# EAGLE design mrf-single-row (EAGLE 5.12)
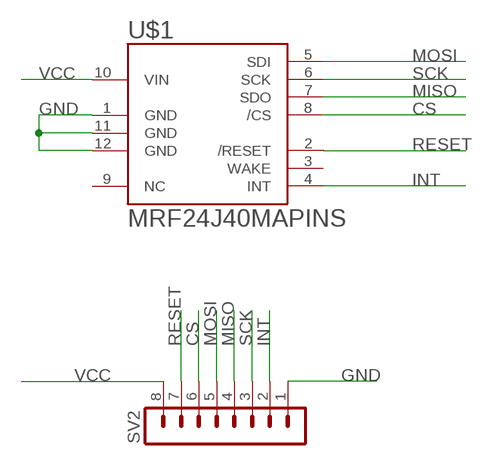
[diagram p0: schematic, sheet 1]

## Parts
SV2  MA08-1  [MA08-1]
U$1  MRF24J40MAPINS  [MRF24J40MA]

## Nets
CS: SV2.6 U$1.8(/CS)
GND: SV2.1 U$1.1(GND) U$1.11(GND) U$1.12(GND)
INT: SV2.2 U$1.4(INT)
MISO: SV2.4 U$1.7(SDO)
MOSI: SV2.5 U$1.5(SDI)
RESET: SV2.7 U$1.2(/RESET)
SCK: SV2.3 U$1.6(SCK)
VCC: SV2.8 U$1.10(VIN)
Unconnected: U$1.3(WAKE) U$1.9(NC)

## Library data of the parts
SV2 = con-lstb:MA08-1: PIN HEADER; OC_FARNELL: unknown; OC_NEWARK: unknown
U$1 = karlnet-parts:MRF24J40MA: MRF24J40MA module, 802.15.4 from microchip.

## Board
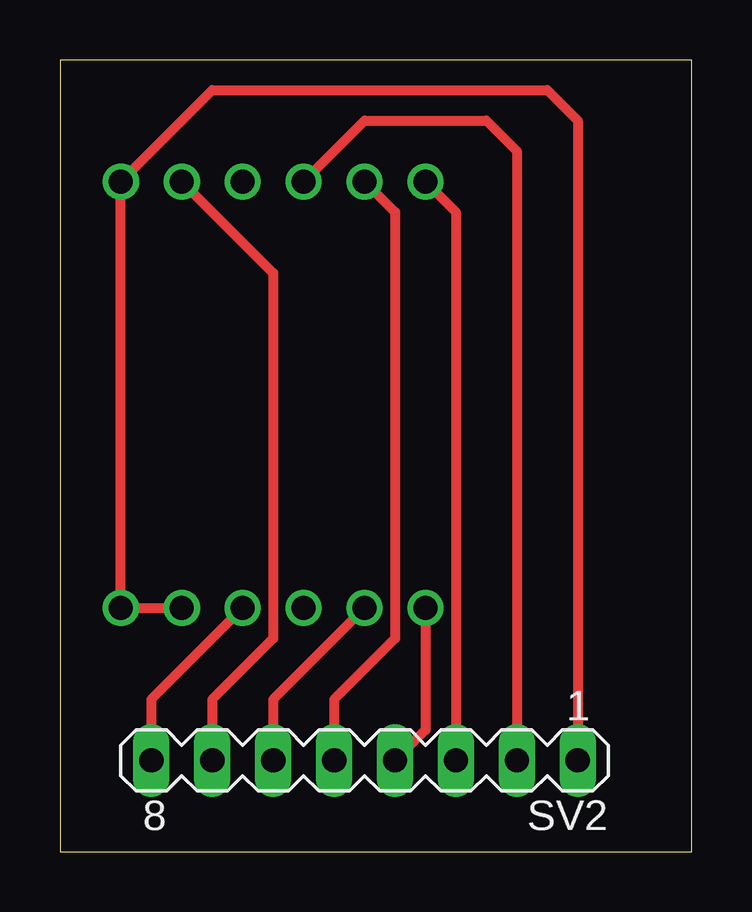
[diagram p1: board, top side]
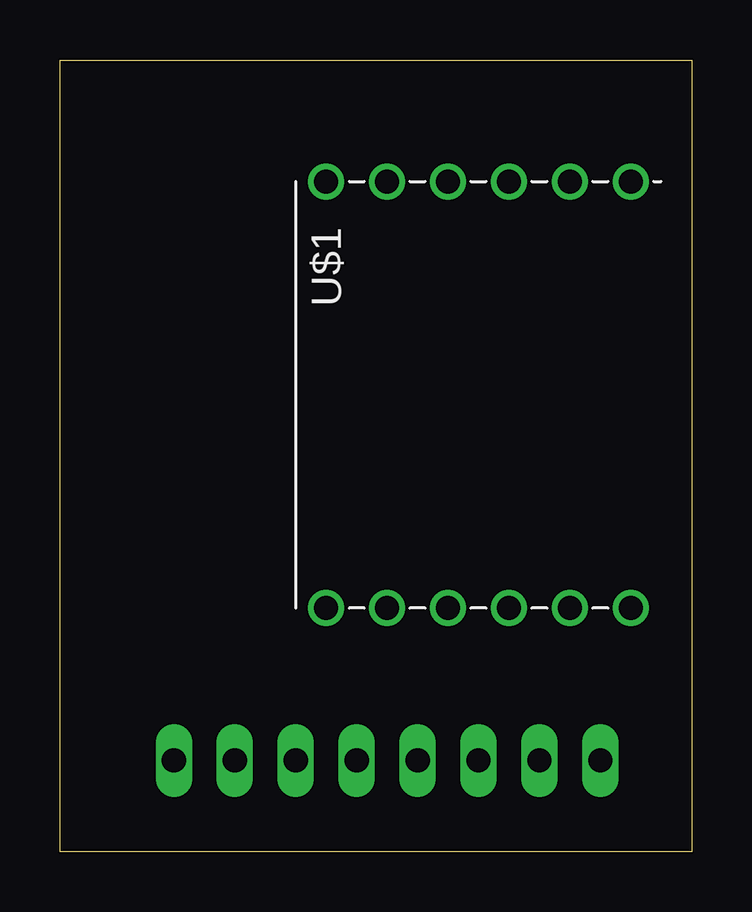
[diagram p2: board, bottom side, seen from below]

Size 26.34 x 33.01 mm. Coordinates in mm from the lower left corner, seen from the top.
Outline: 0,0 26.34,0 26.34,33.01 0,33.01 0,0
Copper layers (1*16): Top 0.035mm / dielectric 1.5mm / Bottom 0.035mm
Design rules "default": minimum track width 10mil, minimum drill 24mil, track to track 8mil, track to pad 8mil, pad to pad 8mil, via to via 8mil, smd to smd 8mil, copper to edge 40mil, drill to drill 8mil, minimum pad ring 10mil, minimum via ring 8mil, stop-mask expansion 4mil, vias tented up to drill 0mil, thermal gap 10mil

### Footprints (pad centres in the part's own frame; a part is rotated, then mirrored left to right if it is on the bottom)
MA08-1 = drill 1.016 long: 1 -8.89,0; 2 -6.35,0; 3 -3.81,0; 4 -1.27,0; 5 1.27,0; 6 3.81,0; 7 6.35,0; 8 8.89,0
MRF24J40MA = drill 1 round: 1 -8.89,12.7; 2 -8.89,10.16; 3 -8.89,7.62; 4 -8.89,5.08; 5 -8.89,2.54; 6 -8.89,0; 7 8.89,0; 8 8.89,2.54; 9 8.89,5.08; 10 8.89,7.62; 11 8.89,10.16; 12 8.89,12.7

### Placement (x,y rotation side)
SV2  12.7,3.81 180 top
U$1  15.24,19.05 270 bottom

### Tracks (layer width: path | path; a pad name or v marks a point on that pad's centre or on a via)
CS
  Top 0.406: U$1.8 8.89,6.35 SV2.6
GND
  Top 0.406: U$1.11 U$1.12 U$1.1 6.35,31.75 20.32,31.75 21.59,30.48 SV2.1
INT
  Top 0.406: U$1.4 12.7,30.48 17.78,30.48 19.05,29.21 SV2.2
MISO
  Top 0.406: U$1.7 15.24,5.08 SV2.4
MOSI
  Top 0.406: U$1.5 13.97,26.67 13.97,8.89 11.43,6.35 SV2.5
RESET
  Top 0.406: U$1.2 8.89,24.13 8.89,8.89 6.35,6.35 SV2.7
SCK
  Top 0.406: U$1.6 16.51,26.67 SV2.3
VCC
  Top 0.406: U$1.10 3.81,6.35 SV2.8